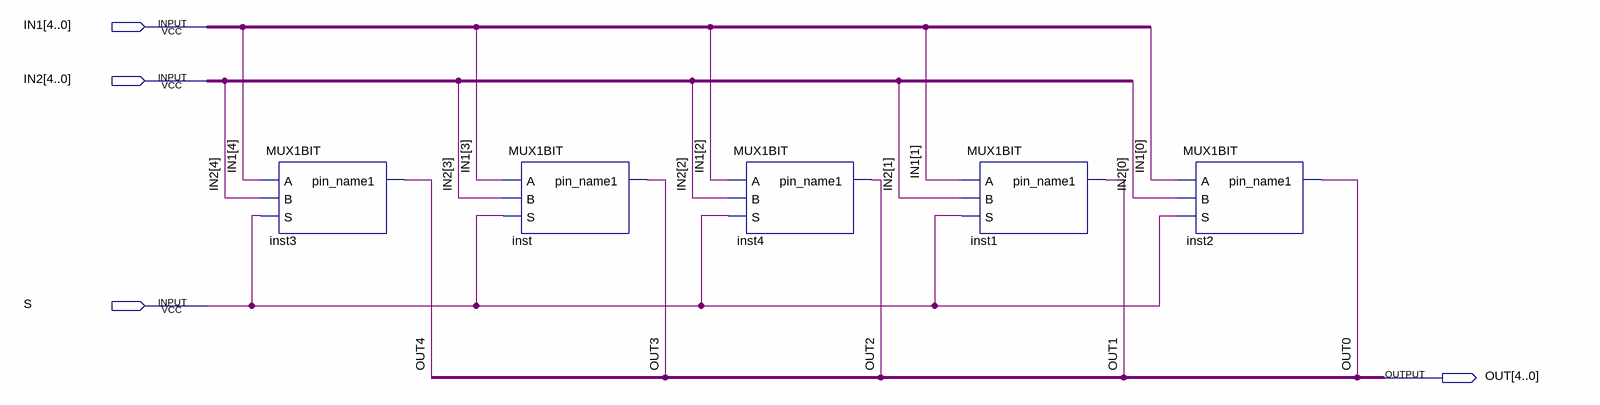
[diagram p0: schematic sheet]
// Quartus schematic MUX5BIT.bdf as structural Verilog: 5 symbols, 4 pins
module MUX5BIT (
  input  [4:0] IN1,
  input  [4:0] IN2,
  input  S,
  output [4:0] OUT
);

  MUX1BIT inst3 (.A(IN1[4]), .B(IN2[4]), .S(S), .pin_name1(OUT[4]));
  MUX1BIT inst (.A(IN1[3]), .B(IN2[3]), .S(S), .pin_name1(OUT[3]));
  MUX1BIT inst4 (.A(IN1[2]), .B(IN2[2]), .S(S), .pin_name1(OUT[2]));
  MUX1BIT inst1 (.A(IN1[1]), .B(IN2[1]), .S(S), .pin_name1(OUT[1]));
  MUX1BIT inst2 (.A(IN1[0]), .B(IN2[0]), .S(S), .pin_name1(OUT[0]));
endmodule
